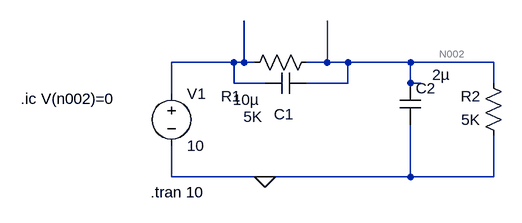
[diagram p0: schematic L1 C3.asc]
L1 C3.asc, the LTspice schematic file:
Version 4
SHEET 1 880 680
WIRE 112 112 16 112
WIRE 128 112 128 48
WIRE 128 112 112 112
WIRE 144 112 128 112
WIRE 256 112 256 48
WIRE 256 112 224 112
WIRE 288 112 256 112
WIRE 384 112 288 112
WIRE 512 112 384 112
WIRE 112 144 112 112
WIRE 160 144 112 144
WIRE 288 144 288 112
WIRE 288 144 224 144
WIRE 384 144 384 112
WIRE 400 144 384 144
WIRE 512 144 512 112
WIRE 16 160 16 112
WIRE 16 288 16 240
WIRE 160 288 16 288
WIRE 384 288 384 208
WIRE 384 288 160 288
WIRE 512 288 512 224
WIRE 512 288 384 288
FLAG 160 288 0
SYMBOL res 240 96 R90
WINDOW 0 84 132 VBottom 2
WINDOW 3 84 98 VTop 2
SYMATTR InstName R1
SYMATTR Value 5K
SYMBOL res 528 240 R180
WINDOW 0 36 76 Left 2
WINDOW 3 36 40 Left 2
SYMATTR InstName R2
SYMATTR Value 5K
SYMBOL cap 224 128 R90
WINDOW 0 79 35 VBottom 2
WINDOW 3 26 93 VTop 2
SYMATTR InstName C1
SYMATTR Value 10µ
SYMBOL voltage 16 144 R0
WINDOW 123 0 0 Left 0
WINDOW 39 0 0 Left 0
SYMATTR InstName V1
SYMATTR Value 10
SYMBOL cap 368 144 R0
WINDOW 3 50 -13 Left 2
SYMATTR Value 2µ
SYMATTR InstName C2
TEXT -16 312 Left 2 !.tran 10
TEXT -216 168 Left 2 !.ic V(n002)=0

The netlist it stands for:
* L1 C3.asc
R1 N002 N001 5K
R2 0 N002 5K
C1 N002 N001 10µ
V1 N001 0 10
C2 N002 0 2µ
.tran 10
.ic V(n002)=0
.backanno
.end